# Altium schematic sheet Detector.SchDoc
size A4
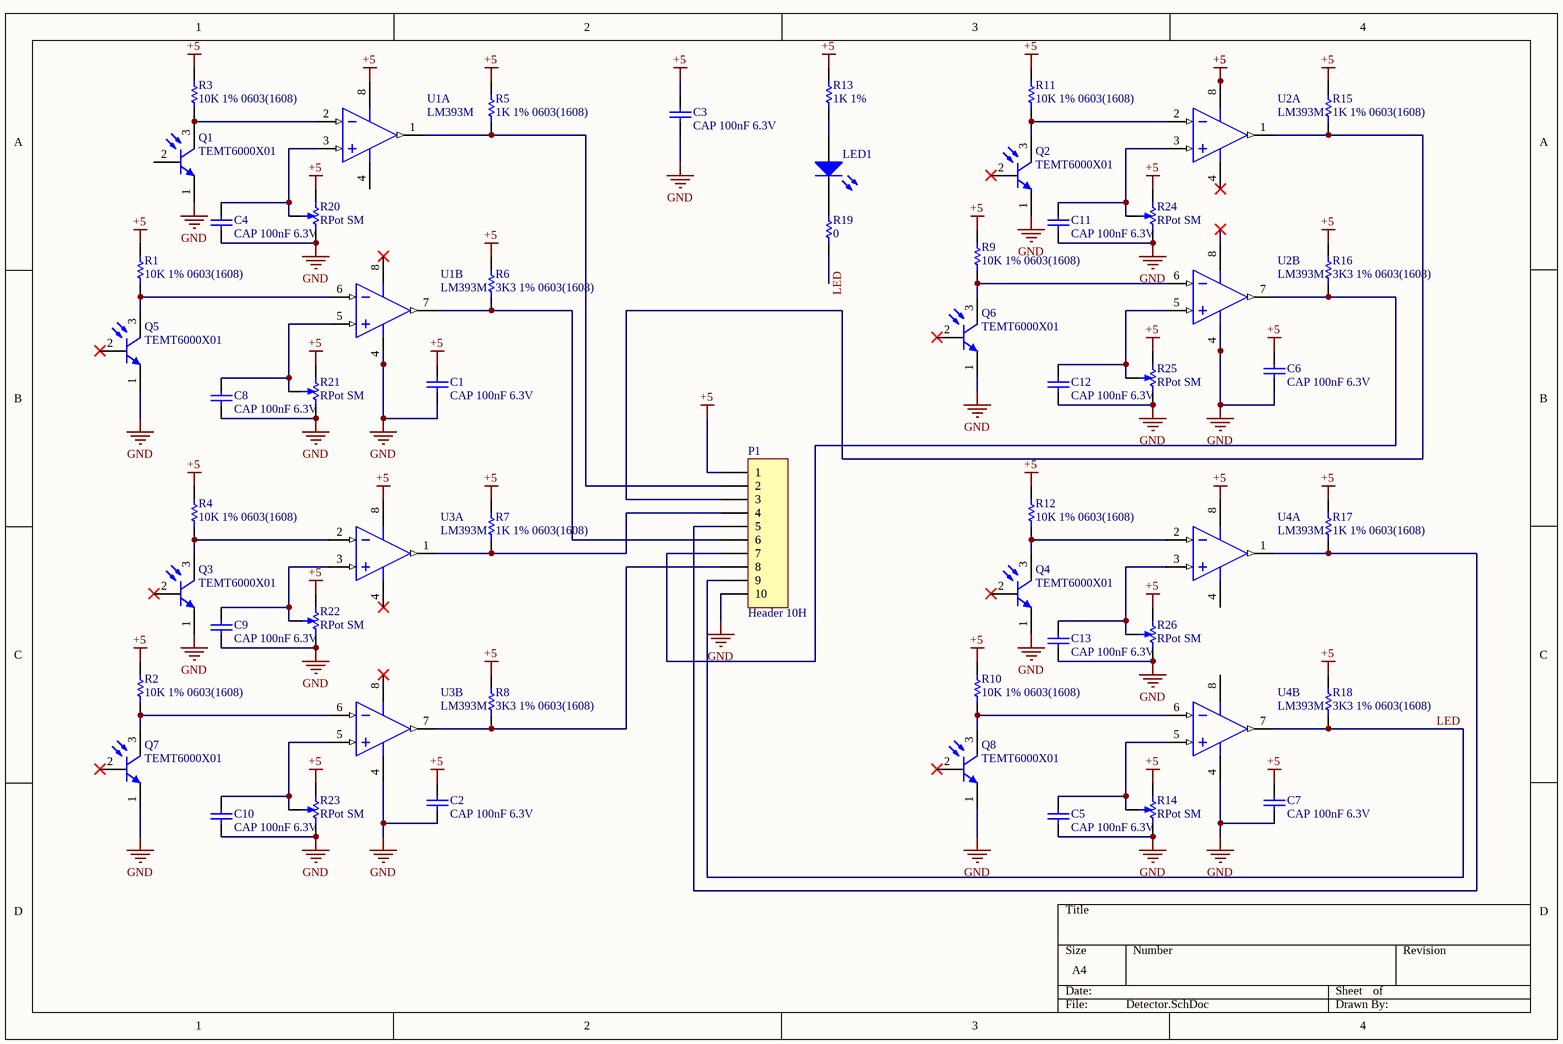
[diagram p0: Detector.SchDoc]

## Parts
C1  CAP 100nF 6.3V  [CAPC0603(1608)100_N]
C2  CAP 100nF 6.3V  [CAPC0603(1608)100_N]
C3  CAP 100nF 6.3V  [CAPC0603(1608)100_N]
C4  CAP 100nF 6.3V  [CAPC0603(1608)100_N]
C5  CAP 100nF 6.3V  [CAPC0603(1608)100_N]
C6  CAP 100nF 6.3V  [CAPC0603(1608)100_N]
C7  CAP 100nF 6.3V  [CAPC0603(1608)100_N]
C8  CAP 100nF 6.3V  [CAPC0603(1608)100_N]
C9  CAP 100nF 6.3V  [CAPC0603(1608)100_N]
C10  CAP 100nF 6.3V  [CAPC0603(1608)100_N]
C11  CAP 100nF 6.3V  [CAPC0603(1608)100_N]
C12  CAP 100nF 6.3V  [CAPC0603(1608)100_N]
C13  CAP 100nF 6.3V  [CAPC0603(1608)100_N]
LED1  150060BS75000  [0603_A]  (value not drawn)
P1  Header 10H  [HDR1X10H]
Q1  TEMT6000X01  [VSIL-TEMT6000X01_V]
Q2  TEMT6000X01  [VSIL-TEMT6000X01_V]
Q3  TEMT6000X01  [VSIL-TEMT6000X01_V]
Q4  TEMT6000X01  [VSIL-TEMT6000X01_V]
Q5  TEMT6000X01  [VSIL-TEMT6000X01_V]
Q6  TEMT6000X01  [VSIL-TEMT6000X01_V]
Q7  TEMT6000X01  [VSIL-TEMT6000X01_V]
Q8  TEMT6000X01  [VSIL-TEMT6000X01_V]
R1  10K 1% 0603(1608)  [RESC0603(1608)_N]
R2  10K 1% 0603(1608)  [RESC0603(1608)_N]
R3  10K 1% 0603(1608)  [RESC0603(1608)_N]
R4  10K 1% 0603(1608)  [RESC0603(1608)_N]
R5  1K 1% 0603(1608)  [RESC0603(1608)_N]
R6  3K3 1% 0603(1608)  [RESC0603(1608)_N]
R7  1K 1% 0603(1608)  [RESC0603(1608)_N]
R8  3K3 1% 0603(1608)  [RESC0603(1608)_N]
R9  10K 1% 0603(1608)  [RESC0603(1608)_N]
R10  10K 1% 0603(1608)  [RESC0603(1608)_N]
R11  10K 1% 0603(1608)  [RESC0603(1608)_N]
R12  10K 1% 0603(1608)  [RESC0603(1608)_N]
R13  1K 1%  [RESC0603(1608)_N]
R14  RPot SM  [POT4MM-2]
R15  1K 1% 0603(1608)  [RESC0603(1608)_N]
R16  3K3 1% 0603(1608)  [RESC0603(1608)_N]
R17  1K 1% 0603(1608)  [RESC0603(1608)_N]
R18  3K3 1% 0603(1608)  [RESC0603(1608)_N]
R19  0  [RESC0603(1608)_N]
R20  RPot SM  [POT4MM-2]
R21  RPot SM  [POT4MM-2]
R22  RPot SM  [POT4MM-2]
R23  RPot SM  [POT4MM-2]
R24  RPot SM  [POT4MM-2]
R25  RPot SM  [POT4MM-2]
R26  RPot SM  [POT4MM-2]
U1  LM393M  [D0008A_L]  (parts A,B of 2)
U2  LM393M  [D0008A_L]  (parts A,B of 2)
U3  LM393M  [D0008A_L]  (parts A,B of 2)
U4  LM393M  [D0008A_L]  (parts A,B of 2)

## Nets
+5: C1.2 C2.2 C3.2 C6.2 C7.2 P1.1 R1.2 R2.2 R3.2 R4.2 R5.2 R6.2 R7.2 R8.2 R9.2 R10.2 R11.2 R12.2 R13.2 R14.CCW(-) R15.2 R16.2 R17.2 R18.2 R20.CCW(-) R21.CCW(-) R22.CCW(-) R23.CCW(-) R24.CCW(-) R25.CCW(-) R26.CCW(-) U1.8(V+) U2.8(V+) U3.8(V+) U4.8(V+)
GND: C1.1 C2.1 C3.1 C4.1 C5.1 C6.1 C7.1 C8.1 C9.1 C10.1 C11.1 C12.1 C13.1 P1.10 Q1.1(E) Q2.1(E) Q3.1(E) Q4.1(E) Q5.1(E) Q6.1(E) Q7.1(E) Q8.1(E) R14.CW(+) R20.CW(+) R21.CW(+) R22.CW(+) R23.CW(+) R24.CW(+) R25.CW(+) R26.CW(+) U1.4(GND) U2.4(GND) U3.4(GND) U4.4(GND)
LED: P1.9 R18.1 R19.1 U4.7(OUTB)
NetC4_2: C4.2 R20.W U1.3(INA+)
NetC5_2: C5.2 R14.W U4.5(INB+)
NetC8_2: C8.2 R21.W U1.5(INB+)
NetC9_2: C9.2 R22.W U3.3(INA+)
NetC10_2: C10.2 R23.W U3.5(INB+)
NetC11_2: C11.2 R24.W U2.3(INA+)
NetC12_2: C12.2 R25.W U2.5(INB+)
NetC13_2: C13.2 R26.W U4.3(INA+)
NetLED1_1: LED1.1(K) R19.2
NetLED1_2: LED1.2(A) R13.1
NetP1_2: P1.2 R5.1 U1.1(OUTA)
NetP1_3: P1.3 R15.1 U2.1(OUTA)
NetP1_4: P1.4 R7.1 U3.1(OUTA)
NetP1_5: P1.5 R17.1 U4.1(OUTA)
NetP1_6: P1.6 R6.1 U1.7(OUTB)
NetP1_7: P1.7 R16.1 U2.7(OUTB)
NetP1_8: P1.8 R8.1 U3.7(OUTB)
NetQ1_3: Q1.3(C) R3.1 U1.2(INA-)
NetQ2_3: Q2.3(C) R11.1 U2.2(INA-)
NetQ3_3: Q3.3(C) R4.1 U3.2(INA-)
NetQ4_3: Q4.3(C) R12.1 U4.2(INA-)
NetQ5_3: Q5.3(C) R1.1 U1.6(INB-)
NetQ6_3: Q6.3(C) R9.1 U2.6(INB-)
NetQ7_3: Q7.3(C) R2.1 U3.6(INB-)
NetQ8_3: Q8.3(C) R10.1 U4.6(INB-)

Not connected (* = marked no-connect by the designer): Q1 2(B); Q2 2(B)*; Q3 2(B)*; Q4 2(B)*; Q5 2(B)*; Q6 2(B)*; Q7 2(B)*; Q8 2(B)*

## Library data of the parts
C1-C13 = CMP-1035-02576-1: CAP 100nF 6.3V ±10% 0603 (1608 Metric) Thickness 1mm SMD; Tolerance: Â±10%; Case-Metric: 1608; Case-EIA: 0603; Max Thickness: 1 mm; Value: 100nF; Rated Voltage: 6.3 V; Technology: SMT
LED1 = CMP-1426-00003-1: SMD mono-color Chip LED, WL-SMCW, Blue; Manufacturer: Wuerth Elektronik; Color: Blue; ComponentLink2Description: Datasheet; ComponentLink2URL: http://katalog.we-online.com/led/datasheet/150060BS75000.pdf; ComponentLink1URL: http://www.we-online.com; PackageReference: 0603_A; PartNumber: 150060BS75000; ComponentLink1Description: Manufacturer URL
P1 = Header 10H: Header, 10-Pin, Right Angle; LatestRevisionDate: 17-Jul-2002; LatestRevisionNote: Re-released for DXP Platform.; Publisher: Altium Limited
Q1-Q8 = CMP-1666-00035-1: Ambient Light Sensor / , 100 mW, -40 to 100 degC, 3-Pin SMD, RoHS, Tape and Reel; Nominal Vf: 2 V; Luminous Intensity: 54 mcd; Forward Current: 20 mA; Viewing Angle: 130 degrees; Lens Style: Diffused; Power Rating: 75 mW; Colour: Red; Case\Package: 0603; Case Code (Imperial): 0603; Package Quantity: 3000; Packaging: Tape and Reel; Width: 0.8 mm; ComponentLink2URL: http://www.vishay.com/docs/81579/temt6000.pdf; ComponentLink1Description: Manufacturer URL; ComponentLink2Description: Datasheet; Height: 0.8 mm; Mount: Surface Mount; Pins: 2; Case Code (Metric): 1608; Max Operating Temperature: 85 degC; DatasheetVersion: Rev. 1.9, 08/2011; Forward Voltage: 2 V; ComponentLink1URL: http://www.vishay.com/; Radiation Hardening: No; RoHSCompliant: true; Length: 1.6 mm; PackageReference: 1206; Min Operating Temperature: -55 degC; PackageDescription: 3-Pin Surface Mount Device, Body 4 x 2 mm; Illumination Colour: Red
R1-R4 R9-R12 = CMP-1012-00623-1: 10K 0.1W 1% 0603 (1608 Metric)  SMD; Value: 10000.00 Ohm; Case-EIA: 0603; Case-Metric: 1608; Power: 0.1 W; Tolerance: 1 %; Technology: SMT
R5-R8 R15-R18 = CMP-1012-00567-1: 3K3 0.1W 1% 0603 (1608 Metric)  SMD; Case-Metric: 1608; Value: 3300.00 Ohm; Case-EIA: 0603; Power: 0.1 W; Tolerance: 1 %; Technology: SMT
R13 R19 = CMP-1012-00510-1: 1K 0.1W 1% 0603 (1608 Metric)  SMD; Case-Metric: 1608; Case-EIA: 0603; Value: 1000.00 Ohm; Technology: SMT; Tolerance: 1 %; Power: 0.1 W
R14 R20-R26 = RPot SM: Square Trimming Potentiometer; Published: 17-Dec-2003; DatasheetVersion: Oct-2003; PackageReference: POT4MM-2; Publisher: Altium Limited; PackageDescription: Square Trimming Potentiometer; ComponentLink1Description: Manufacturer Link; ComponentLink1URL: http://bourns.com/2/search.html
U1-U4 = CMP-0055-00682-3: Low Power Low Offset Voltage Dual Comparator, 8-pin Narrow SOIC; Manufacturer: Texas Instruments; CompType: Amplifiers; PowerWise: N; PackageTopMarking: NSZXTT*LM*393M; PinCount: 8; Code_IPC: SOIC127P600-8; RoHS: N; PackageDescription: SOIC Narrow, 4.9 x 3.9 x 1.45mm, 8 Lead, 1.27mm Pitch; ComponentLink1URL: http://www.ti.com/general/docs/lit/getliterature.tsp?genericPartNumber=LM393-N&fileType=pdf; Code_JEDEC: MS-012-AA; ComponentLink1Description: Datasheet URL; Package Reference: D0008A